# Altium project ASPLogger_Control_Unit.PrjPcb (part 1 of 2)
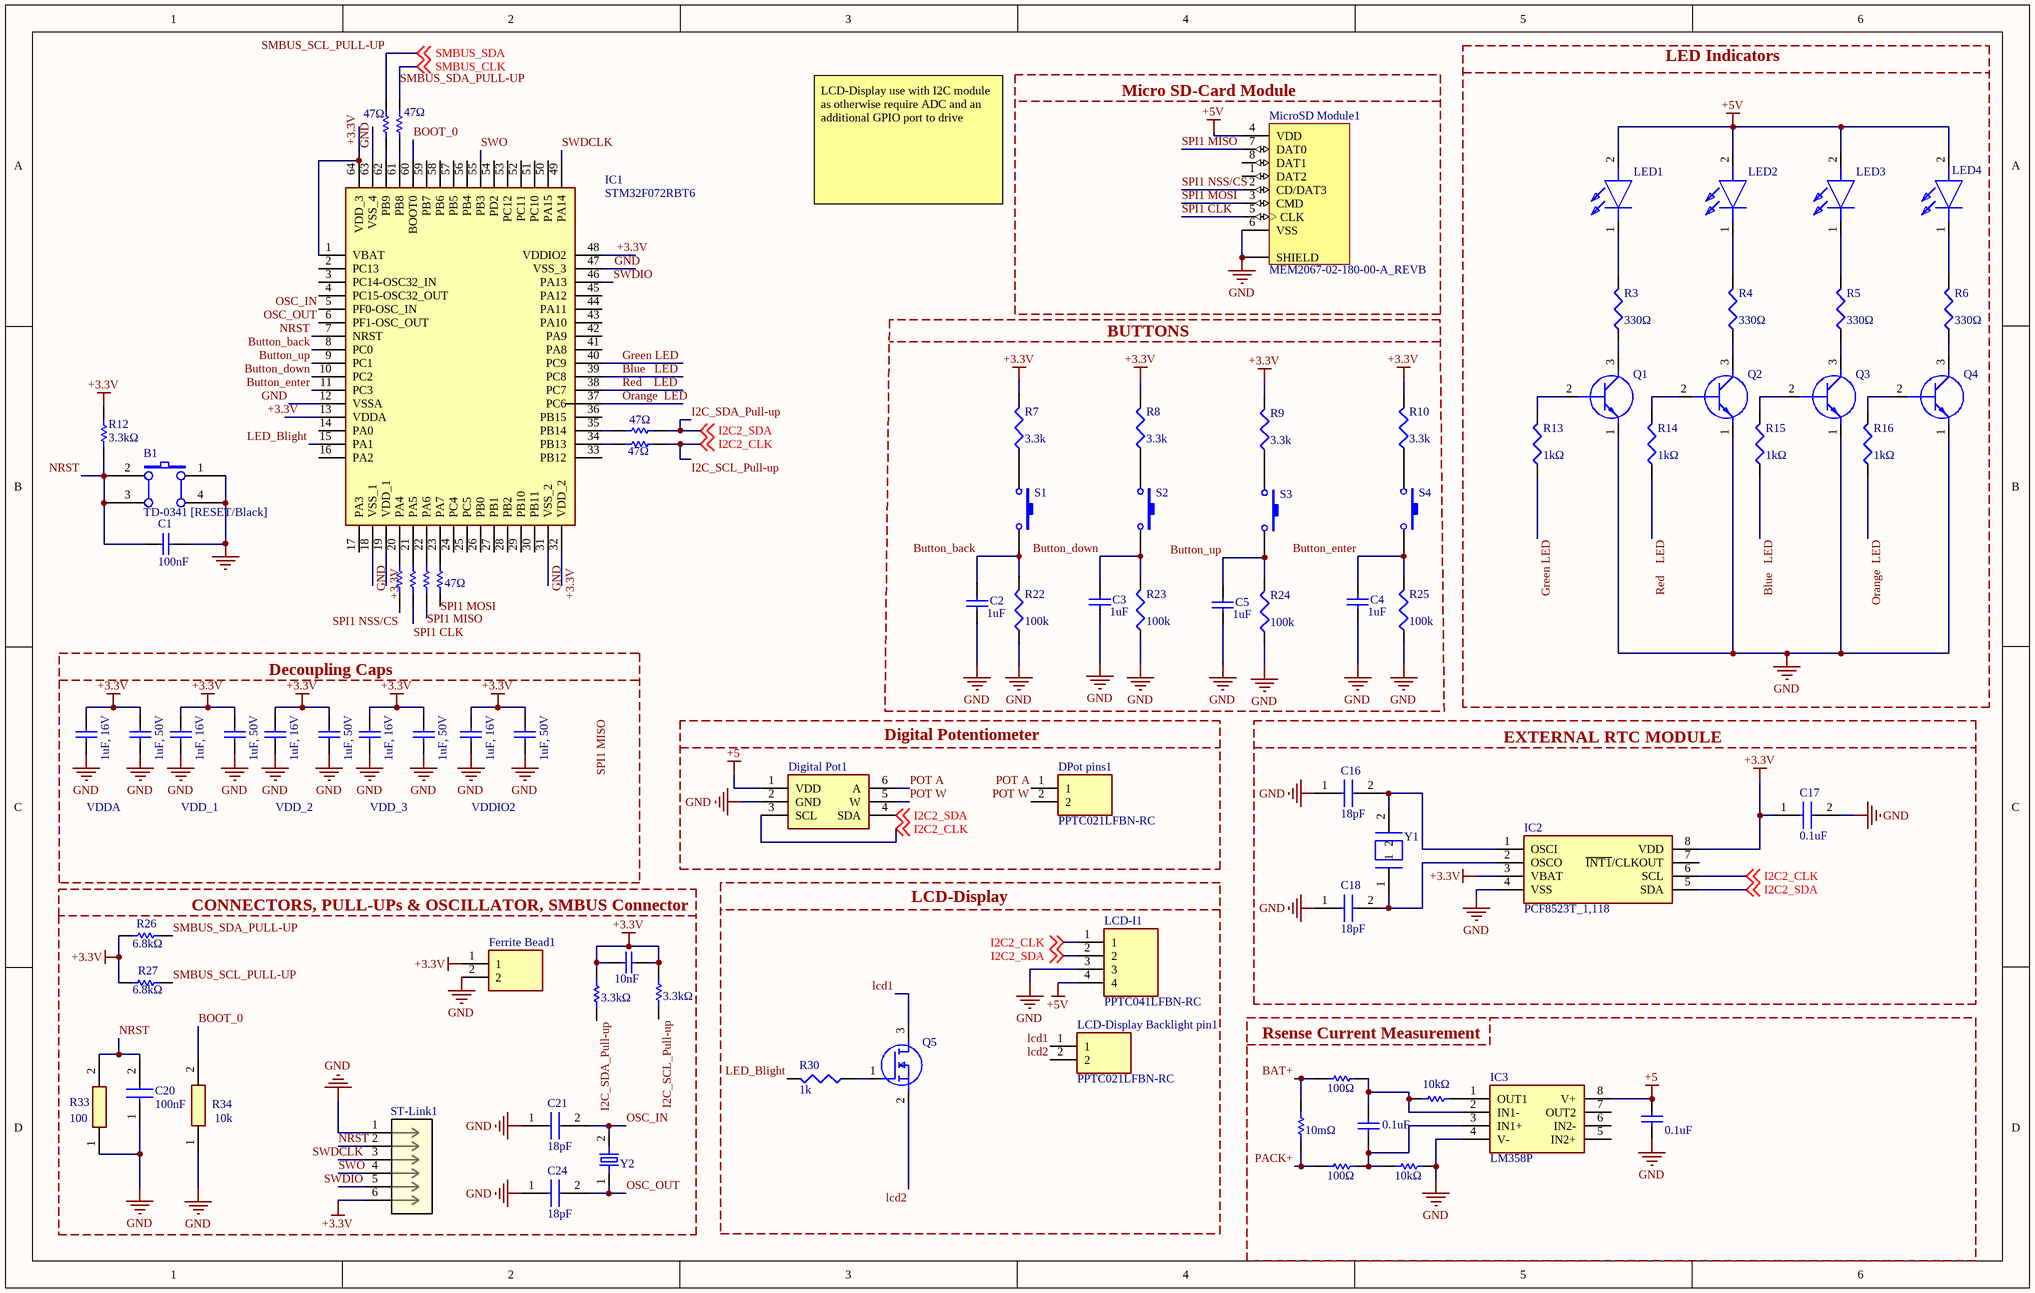
[diagram p0: Sheet1.SchDoc]
5 sheets, 250 parts. Net scope: global (net labels, ports and power ports of the same name join across sheets).
Board file: PCB1.PcbDoc
Sheets:
  Sheet1.SchDoc
  BQ34z100pwr.SchDoc
  LDO.SchDoc
  R5460.SchDoc
  ASP.SchDoc

## Sheet Sheet1.SchDoc
size 381 x 241 mm; SheetNumber: 1; SheetTotal: 5; SPICEModelCacheHRDCRIYR: <root> / <DocumentId>HRDCRIYR</DocumentId> / <CacheFrame Number="0"> / <Model Name="cap" Kind="MDL"> / <Text>*Default semiconductor capacitor / .MODEL CAP C()</Text> / </Model> / </CacheFrame> / </root>

### Parts
B1  TD-0341 [RESET/Black]  [PB10]
C1  100nF  [0603C]
C2  value 1uF  [RAD-0.3]  (hidden comment: Cap)
C3  value 1uF  [RAD-0.3]  (hidden comment: Cap)
C4  value 1uF  [RAD-0.3]  (hidden comment: Cap)
C5  value 1uF  [RAD-0.3]  (hidden comment: Cap)
C6  value 1uF, 16V  [RAD-0.3]  (hidden comment: Cap)
C7  value 1uF, 50V  [RAD-0.3]  (hidden comment: Cap)
C8  value 1uF, 16V  [RAD-0.3]  (hidden comment: Cap)
C9  value 1uF, 50V  [RAD-0.3]  (hidden comment: Cap)
C10  value 1uF, 16V  [RAD-0.3]  (hidden comment: Cap)
C11  value 1uF, 50V  [RAD-0.3]  (hidden comment: Cap)
C12  value 1uF, 16V  [RAD-0.3]  (hidden comment: Cap)
C13  value 1uF, 50V  [RAD-0.3]  (hidden comment: Cap)
C14  value 1uF, 16V  [RAD-0.3]  (hidden comment: Cap)
C15  value 1uF, 50V  [RAD-0.3]  (hidden comment: Cap)
C16  18pF  [CAPC3216X180N]
C17  0.1uF  [CAPC3216X180N]
C18  18pF  [CAPC3216X180N]
C19  value 10nF  [RAD-0.3]  (hidden comment: Cap)
C20  100nF  [CAPC3216X180N]
C21  18pF  [CAPC3216X180N]
C22  value 0.1uF  [RAD-0.3]  (hidden comment: Cap)
C23  value 0.1uF  [RAD-0.3]  (hidden comment: Cap)
C24  18pF  [CAPC3216X180N]
Digital_Pot1  AD5247BKSZ10-2RL7  [SOT65P210X110-6N]  (value not drawn)
DPot_pins1  PPTC021LFBN-RC  [RHDR2W80P0X254_1X2_558X254X850P]
Ferrite_Bead1  2506033007Y3  [BEADC1608X110N]  (value not drawn)
IC1  STM32F072RBT6  [QFP50P1200X1200X160-64N]
IC2  PCF8523T_1,118  [SOIC127P600X175-8N]
IC3  LM358P  [DIP794W53P254L959H508Q8N]
LCD-Display_Backlight_pin1  PPTC021LFBN-RC  [RHDR2W80P0X254_1X2_558X254X850P]
LCD-I1  PPTC041LFBN-RC  [RHDR4W80P0X254_1X4_1066X254X850P]
LED1  L-424IDT  [T-1_(3MM)_CYLINDRICAL_LED_LAMP]  (value not drawn)
LED2  L-424IDT  [T-1_(3MM)_CYLINDRICAL_LED_LAMP]  (value not drawn)
LED3  L-424IDT  [T-1_(3MM)_CYLINDRICAL_LED_LAMP]  (value not drawn)
LED4  L-424IDT  [T-1_(3MM)_CYLINDRICAL_LED_LAMP]  (value not drawn)
MicroSD_Module1  MEM2067-02-180-00-A_REVB  [GCT_MEM2067-02-180-00-A_REVB]
Q1  2n3904  [TO-92]  (value not drawn)
Q2  2n3904  [TO-92]  (value not drawn)
Q3  2n3904  [TO-92]  (value not drawn)
Q4  2n3904  [TO-92]  (value not drawn)
Q5  DMG6968UQ-7  [SOT96P240X100-3N]  (value not drawn)
R1  value 47Ω  [AXIAL-0.3]  (hidden comment: Res1)
R2  value 47Ω  [AXIAL-0.3]  (hidden comment: Res1)
R3  value 330Ω  [J1-0603]  (hidden comment: 330)
R4  value 330Ω  [J1-0603]  (hidden comment: 330)
R5  value 330Ω  [J1-0603]  (hidden comment: 330)
R6  value 330Ω  [J1-0603]  (hidden comment: 330)
R7  value 3.3k  [J1-0603]  (hidden comment: Res3)
R8  value 3.3k  [J1-0603]  (hidden comment: Res3)
R9  value 3.3k  [J1-0603]  (hidden comment: Res3)
R10  value 3.3k  [J1-0603]  (hidden comment: Res3)
R11  value 47Ω  [AXIAL-0.3]  (hidden comment: Res1)
R12  value 3.3kΩ  [AXIAL-0.3]  (hidden comment: Res1)
R13  value 1kΩ  [J1-0603]  (hidden comment: Res3)
R14  value 1kΩ  [J1-0603]  (hidden comment: Res3)
R15  value 1kΩ  [J1-0603]  (hidden comment: Res3)
R16  value 1kΩ  [J1-0603]  (hidden comment: Res3)
R17  value 47Ω  [AXIAL-0.3]  (hidden comment: Res1)
R18  Res1  [AXIAL-0.3]  (value not drawn)
R19  Res1  [AXIAL-0.3]  (value not drawn)
R20  Res1  [AXIAL-0.3]  (value not drawn)
R21  value 47Ω  [AXIAL-0.3]  (hidden comment: Res1)
R22  value 100k  [J1-0603]  (hidden comment: Res3)
R23  value 100k  [J1-0603]  (hidden comment: Res3)
R24  value 100k  [J1-0603]  (hidden comment: Res3)
R25  value 100k  [J1-0603]  (hidden comment: Res3)
R26  value 6.8kΩ  [AXIAL-0.3]  (hidden comment: Res1)
R27  value 6.8kΩ  [AXIAL-0.3]  (hidden comment: Res1)
R28  value 3.3kΩ  [AXIAL-0.3]  (hidden comment: Res1)
R29  value 3.3kΩ  [AXIAL-0.3]  (hidden comment: Res1)
R30  value 1k  [J1-0603]  (hidden comment: Res3)
R31  value 100Ω  [AXIAL-0.3]  (hidden comment: Res1)
R32  value 10kΩ  [AXIAL-0.3]  (hidden comment: Res1)
R33  100  [RESC1608X55N]
R34  10k  [RESC1608X55N]
R35  value 10mΩ  [AXIAL-0.3]  (hidden comment: Res1)
R36  value 100Ω  [AXIAL-0.3]  (hidden comment: Res1)
R37  value 10kΩ  [AXIAL-0.3]  (hidden comment: Res1)
S1  SW-PB  [SPST-2]  (value not drawn)
S2  SW-PB  [SPST-2]  (value not drawn)
S3  SW-PB  [SPST-2]  (value not drawn)
S4  SW-PB  [SPST-2]  (value not drawn)
ST-Link1  20021121-00006C4LF  [CONN_20021121-00006C4LF_AMP-M]  (value not drawn)
Y1  ABS07AIG-32.768KHZ-9-1-T  [XTAL320X150X90]  (value not drawn)
Y2  8 MHz ±20ppm  [XTAL500X320X130N]  (value not drawn)

### Blocks framed on the sheet
LED Indicators: LED1-LED4 Q1-Q4 R3-R6 R13-R16
Micro SD-Card Module: MicroSD_Module1
BUTTONS: C2-C5 R7-R10 R22-R25 S1-S4
Decoupling Caps: C6-C15
Digital Potentiometer: Digital_Pot1 DPot_pins1
LCD-Display: LCD-Display_Backlight_pin1 LCD-I1 Q5 R30
CONNECTORS, PULL-UPs & OSCILLATOR, SMBUS Connector: C19-C21 C24 Ferrite_Bead1 R26-R29 R33 R34 ST-Link1 Y2

### Nets
+3.3V: C6.1 C7.1 C8.1 C9.1 C10.1 C11.1 C12.1 C13.1 C14.1 C15.1 C17.1 C19.1 C19.2 Ferrite_Bead1.1 IC1.1(VBAT) IC1.13(VDDA) IC1.19(VDD_1) IC1.32(VDD_2) IC1.48(VDDIO2) IC1.64(VDD_3) IC2.3(VBAT) IC2.8(VDD) R7.2 R8.2 R9.2 R10.2 R12.2 R26.1 R27.1 R28.1 R29.1 ST-Link1.6
+5V: C22.1 Digital_Pot1.1(VDD) IC3.8(V+) LCD-I1.4 LED1.2(A) LED2.2(A) LED3.2(A) LED4.2(A) MicroSD_Module1.4(VDD)  [also labelled +5]
BAT+: R31.2 R35.2
GND: B1.1(A0) B1.4(A1) C1.1 C2.1 C3.1 C4.1 C5.1 C6.2 C7.2 C8.2 C9.2 C10.2 C11.2 C12.2 C13.2 C14.2 C15.2 C16.1 C17.2 C18.1 C20.1 C21.1 C22.2 C24.1 Digital_Pot1.2(GND) Ferrite_Bead1.2 IC1.12(VSSA) IC1.18(VSS_1) IC1.31(VSS_2) IC1.47(VSS_3) IC1.63(VSS_4) IC2.4(VSS) IC3.4(V-) LCD-I1.3 MicroSD_Module1.6(VSS) MicroSD_Module1.9(SHIELD) MicroSD_Module1.10(SHIELD) MicroSD_Module1.11(SHIELD) MicroSD_Module1.12(SHIELD) Q1.1(E) Q2.1(E) Q3.1(E) Q4.1(E) R22.1 R23.1 R24.1 R25.1 R33.1 R34.1 R37.1 ST-Link1.1
PACK+: R35.1 R36.2
Blue   LED: IC1.39(PC8) R15.1
BOOT_0: IC1.60(BOOT0) R34.2
Button_back: C2.2 IC1.8(PC0) R22.2 S1.2
Button_down: C3.2 IC1.10(PC2) R23.2 S2.2
Button_enter: C4.2 IC1.11(PC3) R25.2 S4.2
Button_up: C5.2 IC1.9(PC1) R24.2 S3.2
Green LED: IC1.40(PC9) R13.1
I2C_SCL_Pull-up: Digital_Pot1.3(SCL) IC2.6(SCL) LCD-I1.1 R17.2 R29.2 ; off-sheet I2C2_CLK  [also labelled I2C2_CLK]
I2C_SDA_Pull-up: Digital_Pot1.4(SDA) IC2.5(SDA) LCD-I1.2 R11.2 R28.2 ; off-sheet I2C2_SDA  [also labelled I2C2_SDA]
lcd1: LCD-Display_Backlight_pin1.1 Q5.3(D)
lcd2: LCD-Display_Backlight_pin1.2 Q5.2(S)
LED_Blight: IC1.15(PA1) R30.2
NRST: B1.2(B0) B1.3(B1) C1.2 C20.2 IC1.7(NRST) R12.1 R33.2 ST-Link1.2
Orange  LED: IC1.37(PC6) R16.1
OSC_IN: C21.2 IC1.5(PF0-OSC_IN) Y2.2
OSC_OUT: C24.2 IC1.6(PF1-OSC_OUT) Y2.1
POT A: Digital_Pot1.6(A) DPot_pins1.1
POT W: Digital_Pot1.5(W) DPot_pins1.2
Red    LED: IC1.38(PC7) R14.1
SMBUS_SCL_PULL-UP: R1.2 R27.2 ; off-sheet SMBUS_SDA  [also labelled SMBUS_SDA]
SMBUS_SDA_PULL-UP: R2.2 R26.2 ; off-sheet SMBUS_CLK  [also labelled SMBUS_CLK]
SPI1 CLK: MicroSD_Module1.5(CLK) R19.1
SPI1 MISO: MicroSD_Module1.7(DAT0) R20.1
SPI1 MOSI: MicroSD_Module1.3(CMD) R21.1
SPI1 NSS/CS: MicroSD_Module1.2(CD/DAT3) R18.1
SWDCLK: IC1.49(PA14) ST-Link1.3
SWDIO: IC1.46(PA13) ST-Link1.5
SWO: IC1.55(PB3) ST-Link1.4
NetC16_2: C16.2 IC2.1(OSCI) Y1.2
NetC18_2: C18.2 IC2.2(OSCO) Y1.1
NetC23_1: C23.1 IC3.3(IN1+) R36.1 R37.2
NetC23_2: C23.2 IC3.2(IN1-) R31.1 R32.2
NetIC1_20: IC1.20(PA4) R18.2
NetIC1_21: IC1.21(PA5) R19.2
NetIC1_22: IC1.22(PA6) R20.2
NetIC1_23: IC1.23(PA7) R21.2
NetIC1_34: IC1.34(PB13) R17.1
NetIC1_35: IC1.35(PB14) R11.1
NetIC1_61: IC1.61(PB8) R2.1
NetIC1_62: IC1.62(PB9) R1.1
NetIC3_1: IC3.1(OUT1) R32.1
NetLED1_1: LED1.1(K) R3.2
NetLED2_1: LED2.1(K) R4.2
NetLED3_1: LED3.1(K) R5.2
NetLED4_1: LED4.1(K) R6.2
NetQ1_2: Q1.2(B) R13.2
NetQ1_3: Q1.3(C) R3.1
NetQ2_2: Q2.2(B) R14.2
NetQ2_3: Q2.3(C) R4.1
NetQ3_2: Q3.2(B) R15.2
NetQ3_3: Q3.3(C) R5.1
NetQ4_2: Q4.2(B) R16.2
NetQ4_3: Q4.3(C) R6.1
NetQ5_1: Q5.1(G) R30.1
NetR7_1: R7.1 S1.1
NetR8_1: R8.1 S2.1
NetR9_1: R9.1 S3.1
NetR10_1: R10.1 S4.1

Not connected (* = marked no-connect by the designer): IC1 2(PC13) 3(PC14-OSC32_IN) 4(PC15-OSC32_OUT) 14(PA0) 16(PA2) 17(PA3) 24(PC4) 25(PC5) 26(PB0) 27(PB1) 28(PB2) 29(PB10) 30(PB11) 33(PB12) 36(PB15) 41(PA8) 42(PA9) 43(PA10) 44(PA11) 45(PA12) 50(PA15) 51(PC10) 52(PC11) 53(PC12) 54(PD2) 56(PB4) 57(PB5) 58(PB6) 59(PB7); IC2 7(~{INT1}/CLKOUT); IC3 5(IN2+) 6(IN2-) 7(OUT2); MicroSD_Module1 1(DAT2) 8(DAT1)

### Notes on the sheet
- LCD-Display use with I2C module as otherwise require ADC and an additional GPIO port to drive
- EXTERNAL RTC MODULE
- VDDA
- VDD_1
- VDD_2
- VDD_3
- VDDIO2
- Rsense Current Measurement
- (near IC3) Noise can propagate into analog circuitry through the power pins of the circuit as a whole, as well as the operational amplifier. Bypass capacitors are used to reduce the coupled noise by providing low-impedance power sources local to the analog circuitry.
- Labels drawn without touching a wire or pin: SPI1 MISO

### Library data of the parts
B1 = SW PUSHBUTTON: SE PUSHBUTTON
C1 = CAP: Capacitor; Value: 100pF; Published: 8-Jun-2000; Revision: July-2002: Re-released for DXP Platform.; Publisher: Altium Limited
C2-C15 C19 C22 C23 = Cap: Capacitor; Published: 8-Jun-2000; LatestRevisionDate: 17-Jul-2002; LatestRevisionNote: Re-released for DXP Platform.; PackageReference: RAD-0.3; Publisher: Altium Limited; PackageDescription: Radial Cap, Thru-Hole; 2 Leads; 0.3 in Pin Spacing
C16-C18 C20 C21 C24 = GRM31CD80J107MEA8L: Capacitor; Manufacturer_Name: Murata Electronics; Height: 1.8mm; Manufacturer_Part_Number: GRM31CD80J107MEA8L; Mouser Part Number: 81-GRM31CD80J107MA8L; Mouser Price/Stock: https://www.mouser.co.uk/ProductDetail/Murata-Electronics/GRM31CD80J107MEA8L?qs=DPoM0jnrROWnWfPYsqocbw%3D%3D
Digital_Pot1 = AD5247BKSZ10-2RL7: Integrated Circuit; Manufacturer_Name: Analog Devices; Datasheet Link: https://www.analog.com/media/en/technical-documentation/data-sheets/AD5247.pdf; Height: 1.1mm; Manufacturer_Part_Number: AD5247BKSZ10-2RL7; Mouser Part Number: 584-AD5247BKSZ10-2R7; Mouser Price/Stock: https://www.mouser.co.uk/ProductDetail/Analog-Devices/AD5247BKSZ10-2RL7?qs=NmRFExCfTkEuDqKDhhBFmQ%3D%3D; Arrow Part Number: AD5247BKSZ10-2RL7; Arrow Price/Stock: https://www.arrow.com/en/products/ad5247bksz10-2rl7/analog-devices
DPot_pins1 LCD-Display_Backlight_pin1 = PPTC021LFBN-RC: Connector; Manufacturer_Name: Sullins; Datasheet Link: http://www.sullinscorp.com/drawings/78_P(N)PxCxxxLFBN-RC,_10492-H.pdf; Height: 8.5mm; Manufacturer_Part_Number: PPTC021LFBN-RC
Ferrite_Bead1 = 2506033007Y3: Ferrite Bead / 100 MHz, 3A, 40 Ohm; Manufacturer_Name: Fair-Rite; Datasheet Link: https://www.fair-rite.com/product/chip-beads-2506033007y3/; Height: 1.1mm; Manufacturer_Part_Number: 2506033007Y3; Mouser Part Number: 623-2506033007Y3; Mouser Price/Stock: https://www.mouser.co.uk/ProductDetail/Fair-Rite/2506033007Y3?qs=paL1wOLBYNf20sf8jiNk7A%3D%3D; Arrow Part Number: 2506033007Y3; Arrow Price/Stock: https://www.arrow.com/en/products/2506033007y3/fair-rite-products
IC1 = STM32F072RBT6: Integrated Circuit; Manufacturer_Name: STMicroelectronics; Datasheet Link: http://www.st.com/st-web-ui/static/active/en/resource/technical/document/datasheet/DM00090510.pdf; Height: 1.6mm; Manufacturer_Part_Number: STM32F072RBT6; Mouser Part Number: 511-STM32F072RBT6; Mouser Price/Stock: https://www.mouser.co.uk/ProductDetail/STMicroelectronics/STM32F072RBT6?qs=xf9JV0PLFEcuk6sTlnutaw%3D%3D; Arrow Part Number: STM32F072RBT6; Arrow Price/Stock: https://www.arrow.com/en/products/stm32f072rbt6/stmicroelectronics
IC2 = PCF8523T_1,118: Integrated Circuit; Manufacturer_Name: NXP; Manufacturer_Part_Number: PCF8523T/1,118; Datasheet Link: http://www.nxp.com/docs/en/data-sheet/PCF8523.pdf; Height: 1.75mm; Mouser Part Number: 771-PCF8523T/1118; Mouser Price/Stock: https://www.mouser.co.uk/ProductDetail/NXP-Semiconductors/PCF8523T-1118?qs=beN0Cyoe8YmmXShRMIPCwg%3D%3D; Arrow Part Number: PCF8523T/1,118; Arrow Price/Stock: https://www.arrow.com/en/products/pcf8523t1118/nxp-semiconductors?region=nac
IC3 = LM358P: Integrated Circuit; Manufacturer_Name: Texas Instruments; Datasheet Link: http://www.ti.com/lit/ds/symlink/lm358a.pdf; Height: 5.08mm; Manufacturer_Part_Number: LM358P; Mouser Part Number: 595-LM358P; Mouser Price/Stock: https://www.mouser.co.uk/ProductDetail/Texas-Instruments/LM358P?qs=X1HXWTtiZ0QtOTT8%252BVnsyw%3D%3D; Arrow Part Number: LM358P; Arrow Price/Stock: https://www.arrow.com/en/products/lm358p/texas-instruments?region=nac
LCD-I1 = PPTC041LFBN-RC: Connector; Manufacturer_Name: Sullins; Datasheet Link: http://www.sullinscorp.com/drawings/78_P(N)PxCxxxLFBN-RC,_10492-H.pdf; Height: 8.5mm; Manufacturer_Part_Number: PPTC041LFBN-RC
LED1-LED4 = L-424IDT: LED; Manufacturer_Name: Kingbright; Datasheet Link: https://componentsearchengine.com/Datasheets/2/L-424IDT.pdf; Manufacturer_Part_Number: L-424IDT; Mouser Part Number: N/A; Mouser Price/Stock: https://www.mouser.com/Search/Refine.aspx?Keyword=N%2FA; Arrow Part Number: L-424IDT; Arrow Price/Stock: https://www.arrow.com/en/products/l-424idt/kingbright
MicroSD_Module1 = MEM2067-02-180-00-A_REVB: 8 Position Card Connector microSDâ„¢ Surface Mount, Right Angle Gold; MF: Global Connector Technology; Package: None; Value: *; Price: None; MP: MEM2067-02-180-00-A; SnapEDA_Link: https://www.snapeda.com/parts/MEM2067-02-180-00-A/Global%20Connector%20Technology/view-part/779218/?ref=snap; Availability: Unavailable
Q1-Q4 = 2n3904: Transistor BJT NPN; Manufacturer_Name: STMicroelectronics; Datasheet Link: https://datasheet.datasheetarchive.com/originals/distributors/Datasheets-5/DSA-93219.pdf; Manufacturer_Part_Number: 2n3904; Mouser Part Number: 511-2N3904; Mouser Price/Stock: https://www.mouser.co.uk/ProductDetail/STMicroelectronics/2N3904?qs=ljbEvF4DwOMFlSOlAhVGRg%3D%3D
Q5 = DMG6968UQ-7: MOSFET (N-Channel); Manufacturer_Name: Diodes Inc.; Datasheet Link: https://www.arrow.com/en/products/dmg6968uq-7/diodes-incorporated; Height: 1mm; Manufacturer_Part_Number: DMG6968UQ-7; Mouser Part Number: 621-DMG6968UQ-7; Mouser Price/Stock: https://www.mouser.co.uk/ProductDetail/Diodes-Incorporated/DMG6968UQ-7?qs=MNIFWdyJgboErGB0%2FFpP4Q%3D%3D; Arrow Part Number: DMG6968UQ-7; Arrow Price/Stock: https://www.arrow.com/en/products/dmg6968uq-7/diodes-incorporated
R1 R2 R11 R12 R17 R21 R26-R29 R31 R32 R35-R37 = Res1: Resistor; Published: 8-Jun-2000; LatestRevisionDate: 17-Jul-2002; LatestRevisionNote: Re-released for DXP Platform.; PackageReference: AXIAL-0.3; Publisher: Altium Limited; PackageDescription: Axial Device, Thru-Hole; 2 Leads; 0.3 in Pin Spacing
R3-R10 R13-R16 R22-R25 R30 = Res3: Resistor; Published: 8-Jun-2000; LatestRevisionDate: 29-May-2009; LatestRevisionNote: IPC-7351 Footprint Added.; PackageReference: J1-0603; Publisher: Altium Limited; PackageDescription: Chip Resistor
R18 = Res1: Resistor; Value: 1kΩ; Published: 8-Jun-2000; LatestRevisionDate: 17-Jul-2002; LatestRevisionNote: Re-released for DXP Platform.; PackageReference: AXIAL-0.3; Publisher: Altium Limited; PackageDescription: Axial Device, Thru-Hole; 2 Leads; 0.3 in Pin Spacing
R19 R20 = Res1: Resistor; Value: 47Ω; Published: 8-Jun-2000; LatestRevisionDate: 17-Jul-2002; LatestRevisionNote: Re-released for DXP Platform.; PackageReference: AXIAL-0.3; Publisher: Altium Limited; PackageDescription: Axial Device, Thru-Hole; 2 Leads; 0.3 in Pin Spacing
R33 R34 = CRG0603F470R: Resistor; Manufacturer_Name: TE Connectivity; Datasheet Link: https://datasheet.datasheetarchive.com/originals/distributors/DKDS-21/401698.pdf; Height: 0.55mm; Manufacturer_Part_Number: CRG0603F470R; Mouser Part Number: 279-CRG0603F470R; Mouser Price/Stock: https://www.mouser.co.uk/ProductDetail/TE-Connectivity-Holsworthy/CRG0603F470R?qs=VHcS2MTj4gZ9vO%2FWGoSTFA%3D%3D; Arrow Part Number: CRG0603F470R; Arrow Price/Stock: https://www.arrow.com/en/products/crg0603f470r/te-connectivity?region=nac
S1-S4 = SW-PB: Switch; Published: 24-Mar-1999; LatestRevisionDate: 17-Jul-2002; LatestRevisionNote: Re-released for DXP Platform.; PackageReference: SPST-2; Publisher: Altium Limited; PackageDescription: Switch; 2 Leads
ST-Link1 = 20021121-00006C4LF: ST-Link; Mfr_Name: Amphenol ICC; Manufacturer_Part_Number: 20021121-00006C4LF; Copyright: Copyright (C) 2022 Ultra Librarian. All rights reserved.; RefDes: RefDes; Type: DEV
Y1 = ABS07AIG-32.768KHZ-9-1-T: 32.768kHz Â±10ppm Crystal 9pF 80 kOhms 2-SMD, No Lead; MF: Abracon; Package: SMD-2 Abracon; MP: ABS07AIG-32.768KHZ-9-1-T; SnapEDA_Link: https://www.snapeda.com/parts/ABS07AIG-32.768KHZ-9-1-T/Abracon%20LLC/view-part/588516/?ref=snap; Price: None; Value: *; Availability: Unavailable
Y2 = ABM3-16.000MHZ-D2Y-T: 16MHz Â±20ppm Crystal 18pF 40 Ohms 2-SMD, No Lead; MF: Abracon; SnapEDA_Link: https://www.snapeda.com/parts/ABM3-16.000MHZ-D2Y/Abracon/view-part/1217081/?ref=snap; MP: ABM3-16.000MHZ-D2Y; Availability: Unavailable; Package: SMD-2 Abracon; Price: None; Value: *

## Sheet BQ34z100pwr.SchDoc
size A4; SheetNumber: 2; SheetTotal: 4
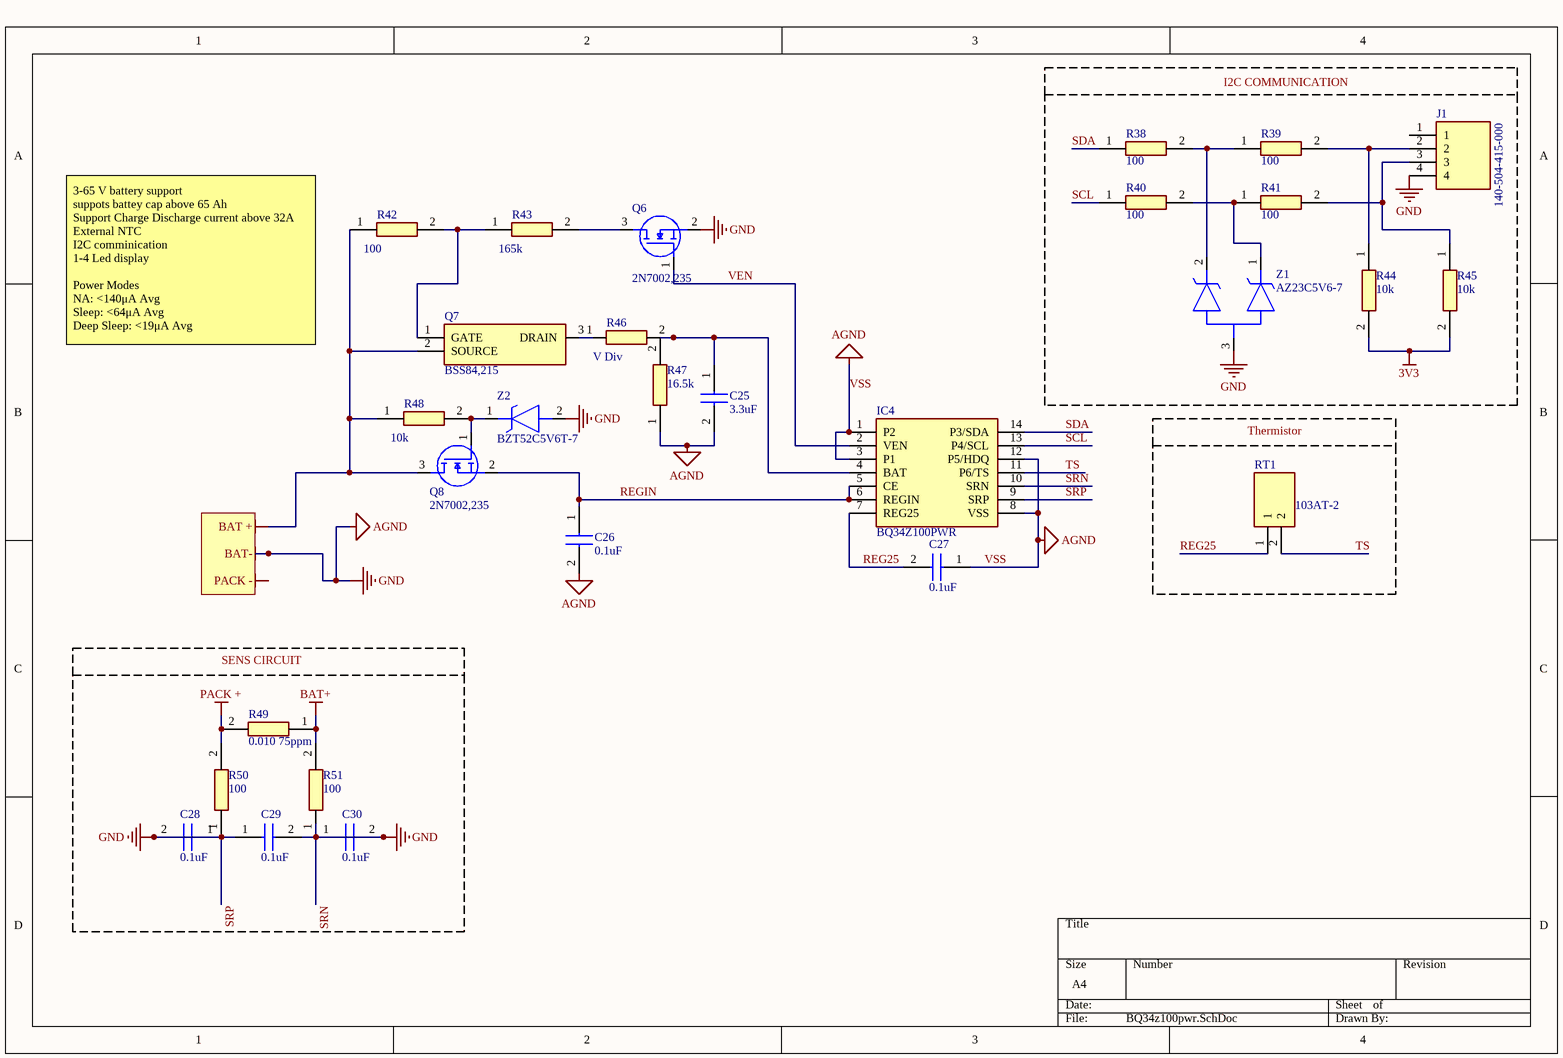
[diagram p1: BQ34z100pwr.SchDoc]

### Parts
C25  3.3uF  [CAPC1608X90N]
C26  0.1uF  [CAPC1608X90N]
C27  0.1uF  [CAPC1608X90N]
C28  0.1uF  [CAPC1608X90N]
C29  0.1uF  [CAPC1608X90N]
C30  0.1uF  [CAPC1608X90N]
IC4  BQ34Z100PWR  [SOP65P640X120-14N]
J1  140-504-415-000  [140504415000]
Q6  2N7002,235  [SOT95P230X110-3N]
Q7  BSS84,215  [SOT95P230X110-3N]
Q8  2N7002,235  [SOT95P230X110-3N]
R38  100  [RESC1608X55N]
R39  100  [RESC1608X55N]
R40  100  [RESC1608X55N]
R41  100  [RESC1608X55N]
R42  100  [RESC1608X55N]
R43  165k  [RESC1608X55N]
R44  10k  [RESC1608X55N]
R45  10k  [RESC1608X55N]
R46  V Div  [RESC1608X55N]
R47  16.5k  [RESC1608X55N]
R48  10k  [RESC1608X55N]
R49  0.010 75ppm  [RESC1608X55N]
R50  100  [RESC1608X55N]
R51  100  [RESC1608X55N]
RT1  103AT-2  [103AT2]
Z1  AZ23C5V6-7  [SOT96P240X110-3N]
Z2  BZT52C5V6T-7  [SODFL1608X65N]

### Blocks framed on the sheet
I2C COMMUNICATION: J1 R38-R41 R44 R45 Z1
Thermistor: RT1
SENS CIRCUIT: C28-C30 R49-R51

### Nets
3V3: R44.2 R45.2
BAT +: Q7.2(SOURCE) Q8.3(D) R42.1 R48.1
BAT+: R49.1 R51.2
GND: C25.2 C26.2 C27.1 C28.1 C28.2 C29.1 C29.2 C30.1 C30.2 IC4.1(P2) IC4.3(P1) IC4.8(VSS) IC4.9(SRP) IC4.10(SRN) IC4.12(P5/HDQ) J1.4 Q6.2(S) R47.1 R50.1 R51.1 Z1.3(COMMON_ANODE) Z2.2(A)  [also labelled AGND, BAT-, SRN, SRP, VSS]
PACK +: R49.2 R50.2
REG25: C27.2 IC4.7(REG25) RT1.1
REGIN: C26.1 IC4.5(CE) IC4.6(REGIN) Q8.2(S)
SCL: IC4.13(P4/SCL) R40.1
SDA: IC4.14(P3/SDA) R38.1
TS: IC4.11(P6/TS) RT1.2
VEN: IC4.2(VEN) Q6.1(G)
NetC25_1: C25.1 IC4.4(BAT) R46.2 R47.2
NetJ1_2: J1.2 R39.2 R44.1
NetJ1_3: J1.3 R41.2 R45.1
NetQ6_3: Q6.3(D) R43.2
NetQ7_1: Q7.1(GATE) R42.2 R43.1
NetQ7_3: Q7.3(DRAIN) R46.1
NetQ8_1: Q8.1(G) R48.2 Z2.1(K)
NetR38_2: R38.2 R39.1 Z1.2(CATHODE_2)
NetR40_2: R40.2 R41.1 Z1.1(CATHODE_1)

Not connected (* = marked no-connect by the designer): J1 1

### Notes on the sheet
- 3-65 V battery support
  suppots battey cap above 65 Ah
  Support Charge Discharge current above 32A
  External NTC
  I2C comminication
  1-4 Led display
  Power Modes
  NA: <140μA Avg
  Sleep: <64μA Avg
  Deep Sleep: <19μA Avg
- Labels drawn without touching a wire or pin: PACK -

### Library data of the parts
C25-C30 = EMK107B7104KAHT: Capacitor; Manufacturer_Name: TAIYO YUDEN; Datasheet Link: https://componentsearchengine.com/Datasheets/2/EMK107B7104KAHT.pdf; Height: 0.9mm; Manufacturer_Part_Number: EMK107B7104KAHT; Mouser Part Number: 963-EMK107B7104KAHT; Mouser Price/Stock: https://www.mouser.co.uk/ProductDetail/Taiyo-Yuden/EMK107B7104KAHT?qs=Va%252BXcMGJzEvYcymJV6GEGg%3D%3D
IC4 = BQ34Z100PWR: Integrated Circuit; Manufacturer_Name: Texas Instruments; Datasheet Link: https://www.ti.com/lit/ds/symlink/bq34z100.pdf?HQS=dis-dk-null-digikeymode-dsf-pf-null-wwe&ts=1639563438358&ref_url=https%253A%252F%252Fwww.ti.com%252Fgeneral%252Fdocs%252Fsuppproductinfo.tsp%253FdistId%253D10%2526gotoUrl%253Dhttps%253A%252F%252Fwww.ti.co; Height: 1.2mm; Manufacturer_Part_Number: BQ34Z100PWR; Mouser Part Number: 595-BQ34Z100PWR; Mouser Price/Stock: https://www.mouser.co.uk/ProductDetail/Texas-Instruments/BQ34Z100PWR?qs=Zv8nmyeoaKtU157avFmCXg%3D%3D; Arrow Part Number: BQ34Z100PWR; Arrow Price/Stock: https://www.arrow.com/en/products/bq34z100pwr/texas-instruments
J1 = 140-504-415-000: Connector; Manufacturer_Name: EDAC; Datasheet Link: https://files.edac.net/edac/content/140/140-504-415-000%20-%20EDAC%20E-MATE%20(Pin%20Header)%20Connector.PDF; Height: 5.25mm; Manufacturer_Part_Number: 140-504-415-000; Mouser Part Number: 587-140-504-415-000; Mouser Price/Stock: https://www.mouser.co.uk/ProductDetail/EDAC/140-504-415-000?qs=zW32dvEIR3t2whP8kwSMKQ%3D%3D
Q6 Q8 = 2N7002,235: MOSFET (N-Channel); Manufacturer_Name: Nexperia; Datasheet Link: https://assets.nexperia.com/documents/data-sheet/2N7002.pdf; Height: 1.1mm; Manufacturer_Part_Number: 2N7002,235; Mouser Part Number: 771-2N7002235; Mouser Price/Stock: https://www.mouser.co.uk/ProductDetail/Nexperia/2N7002235?qs=AX3SRYwdf7Gv59FeQZ%2FkYw%3D%3D; Arrow Part Number: 2N7002,235; Arrow Price/Stock: https://www.arrow.com/en/products/2n7002235/nexperia
Q7 = BSS84,215: Transistor; Manufacturer_Name: Nexperia; Datasheet Link: https://componentsearchengine.com/Datasheets/2/BSS84,215.pdf; Height: 1.1mm; Manufacturer_Part_Number: BSS84,215; Mouser Part Number: 771-BSS84-T/R; Mouser Price/Stock: https://www.mouser.co.uk/ProductDetail/Nexperia/BSS84215?qs=me8TqzrmIYUAnPU0lBnsXg%3D%3D; Arrow Part Number: BSS84,215; Arrow Price/Stock: https://www.arrow.com/en/products/bss84215/nexperia?region=nac
R38-R51 = CR0603-FX-1003ELF: Resistor; Manufacturer_Name: Bourns; Datasheet Link: https://www.bourns.com/pdfs/chpreztr.pdf; Height: 0.55mm; Manufacturer_Part_Number: CR0603-FX-1003ELF; Mouser Part Number: 652-CR0603-FX-103ELF; Mouser Price/Stock: https://www.mouser.co.uk/ProductDetail/Bourns/CR0603-FX-1003ELF?qs=K5ddiUFZPT49r0RoKWcKqg%3D%3D; Arrow Part Number: CR0603-FX-1003ELF; Arrow Price/Stock: https://www.arrow.com/en/products/cr0603-fx-1003elf/bourns?region=europe
RT1 = 103AT-2: Thermistor; Manufacturer_Name: Semitec; Datasheet Link: https://datasheet.datasheetarchive.com/originals/distributors/Datasheets-30/DSA-588185.pdf; Height: 8mm; Manufacturer_Part_Number: 103AT-2; Mouser Part Number: 954-103AT-2; Mouser Price/Stock: https://www.mouser.co.uk/ProductDetail/Semitec/103AT-2?qs=wgO0AD0o1vvcDzsKguD%252Bew%3D%3D
Z1 = AZ23C5V6-7: Zener Diode; Manufacturer_Name: Diodes Inc.; Datasheet Link: https://www.diodes.com/assets/Datasheets/ds18003.pdf; Height: 1.1mm; Manufacturer_Part_Number: AZ23C5V6-7; Mouser Part Number: 621-AZ23C5V6; Mouser Price/Stock: https://www.mouser.co.uk/ProductDetail/Diodes-Incorporated/AZ23C5V6-7?qs=SSucg2PyLi7liuy0Pq8%2FiA%3D%3D
Z2 = BZT52C5V6T-7: Zener Diode; Manufacturer_Name: Diodes Inc.; Datasheet Link: https://www.mouser.com/datasheet/2/115/ds30502-1142513.pdf; Height: 0.65mm; Manufacturer_Part_Number: BZT52C5V6T-7; Mouser Part Number: 621-BZT52C5V6T-7; Mouser Price/Stock: https://www.mouser.co.uk/ProductDetail/Diodes-Incorporated/BZT52C5V6T-7?qs=zLeapIUCO8Tm%252BIuaCPAdkQ%3D%3D; Arrow Part Number: BZT52C5V6T-7; Arrow Price/Stock: https://www.arrow.com/en/products/bzt52c5v6t-7/diodes-incorporated?region=nac

## Sheet LDO.SchDoc
size A4; SheetNumber: 3; SheetTotal: 4
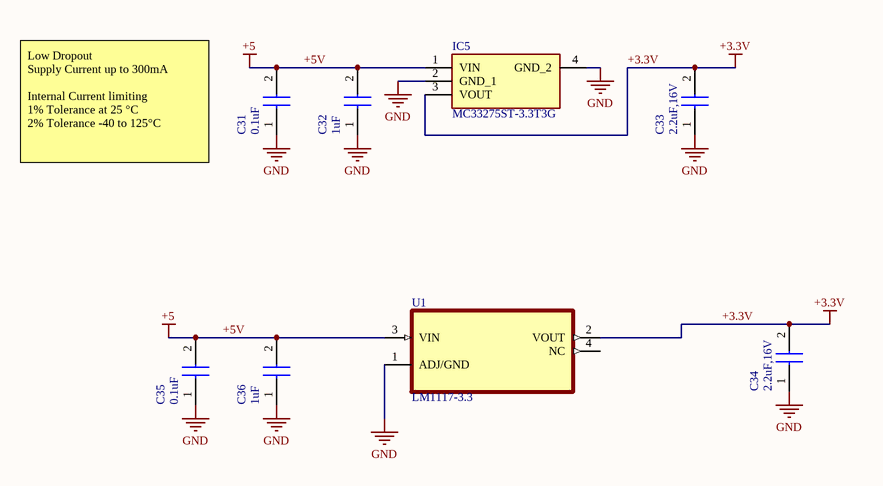
[diagram p2: LDO.SchDoc]

### Parts
C31  0.1uF  [CAPC1608X90N]
C32  1uF  [CAPC1608X90N]
C33  2.2uF,16V  [CAPC1608X90N]
C34  2.2uF,16V  [CAPC1608X90N]
C35  0.1uF  [CAPC1608X90N]
C36  1uF  [CAPC1608X90N]
IC5  MC33275ST-3.3T3G  [SOT230P700X175-4N]
U1  LM1117-3.3  [SOT230]

### Nets
+3.3V: C33.2 C34.2 IC5.3(VOUT) U1.2(VOUT)
+5V: C31.2 C32.2 C35.2 C36.2 IC5.1(VIN) U1.3(VIN)  [also labelled +5]
GND: C31.1 C32.1 C33.1 C34.1 C35.1 C36.1 IC5.2(GND_1) IC5.4(GND_2) U1.1(ADJ/GND)

Not connected (* = marked no-connect by the designer): U1 4(NC)

### Notes on the sheet
- Low Dropout
  Supply Current up to 300mA
  Internal Current limiting
  1% Tolerance at 25 °C
  2% Tolerance -40 to 125°C

### Library data of the parts
C31-C36 = EMK107B7104KAHT: as C25 on sheet BQ34z100pwr; Datasheet Link: https://componentsearchengine.com/Datasheets/2/EMK107B7104KAHT.pdf; Height: 0.9mm; Manufacturer_Part_Number: EMK107B7104KAHT; Mouser Part Number: 963-EMK107B7104KAHT; Mouser Price/Stock: https://www.mouser.co.uk/ProductDetail/Taiyo-Yuden/EMK107B7104KAHT?qs=Va%252BXcMGJzEvYcymJV6GEGg%3D%3D
IC5 = MC33275ST-3.3T3G: Integrated Circuit; Manufacturer_Name: onsemi; Datasheet Link: http://www.onsemi.com/pub/Collateral/MC33275-D.PDF; Height: 1.75mm; Manufacturer_Part_Number: MC33275ST-3.3T3G; Mouser Part Number: 863-MC33275ST-3.3T3G; Mouser Price/Stock: https://www.mouser.co.uk/ProductDetail/ON-Semiconductor/MC33275ST-33T3G?qs=dFKnUM%2FquJbQYa4LZ%2FVbxA%3D%3D; Arrow Part Number: MC33275ST-3.3T3G; Arrow Price/Stock: https://www.arrow.com/en/products/mc33275st-3.3t3g/on-semiconductor
U1 = LM1117-3.3: Regulador de tensÃ£o linear IC 1 Output 800mA SOT-223-4; MF: Texas Instruments; MP: LM1117-3.3; Package: SOT-223-4 Texas Instruments; Price: None; Availability: Unavailable; SnapEDA_Link: https://www.snapeda.com/parts/LM1117-3.3/Texas%20Instruments/view-part/549181/?ref=snap; Value: *

## Sheet R5460.SchDoc
size A4; SheetNumber: 4; SheetTotal: 5
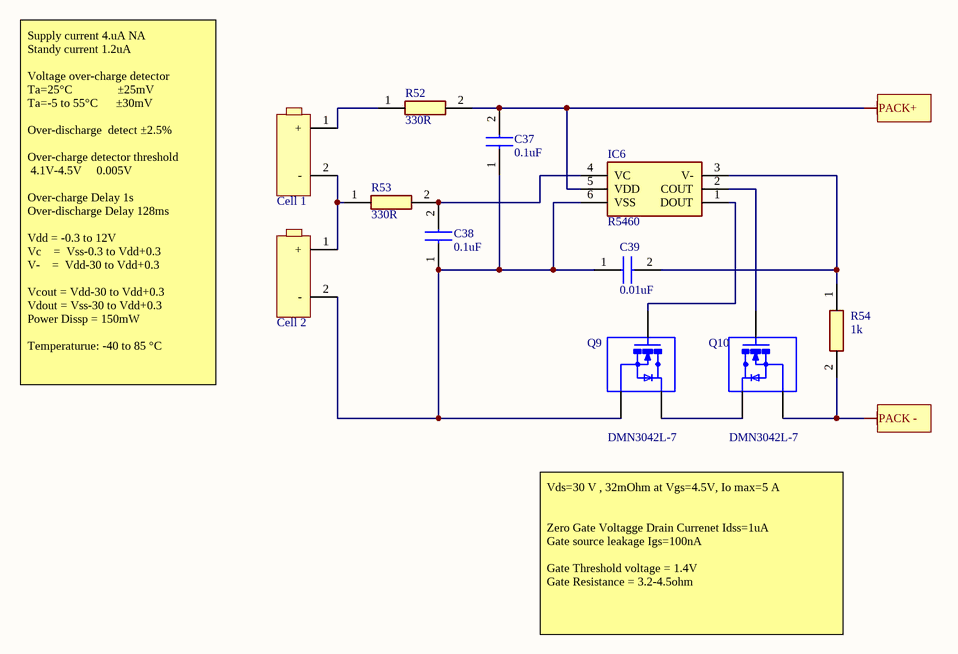
[diagram p3: R5460.SchDoc]

### Parts
C37  0.1uF  [CAPC3216X180N]
C38  0.1uF  [CAPC3216X180N]
C39  0.01uF  [CAPC3216X180N]
Cell_1  Cell  [Cell]  (value not drawn)
Cell_2  Cell  [Cell]  (value not drawn)
IC6  R5460  [SOT95P280X140-6N]
Q9  DMN3042L-7  [SOT91P240X110-3N]
Q10  DMN3042L-7  [SOT91P240X110-3N]
R52  330R  [RESC1608X55N]
R53  330R  [RESC1608X55N]
R54  1k  [RESC1608X55N]

### Nets
PACK -: Q10.2(SOURCE) R54.2
PACK+: C37.2 IC6.5(VDD) R52.2
NetC37_1: C37.1 C38.1 C39.1 Cell_2.2(-) IC6.6(VSS) Q9.2(SOURCE)
NetC38_2: C38.2 IC6.4(VC) R53.2
NetC39_2: C39.2 IC6.3(V-) R54.1
NetCell_1_1: Cell_1.1(+) R52.1
NetCell_1_2: Cell_1.2(-) Cell_2.1(+) R53.1
NetIC6_1: IC6.1(DOUT) Q9.1(GATE)
NetIC6_2: IC6.2(COUT) Q10.1(GATE)
NetQ9_3: Q9.3(DRAIN) Q10.3(DRAIN)

### Notes on the sheet
- Supply current 4.uA NA
  Standy current 1.2uA
  Voltage over-charge detector
  Ta=25°C               ±25mV
  Ta=-5 to 55°C      ±30mV
  Over-discharge  detect ±2.5%
  Over-charge detector threshold
  4.1V-4.5V     0.005V
  Over-charge Delay 1s
  Over-discharge Delay 128ms
  Vdd = -0.3 to 12V
  Vc    =  Vss-0.3 to Vdd+0.3
  V-    =  Vdd-30 to Vdd+0.3
  Vcout = Vdd-30 to Vdd+0.3
  Vdout = Vss-30 to Vdd+0.3
  Power Dissp = 150mW
  Temperaturue: -40 to 85 °C
- Vds=30 V , 32mOhm at Vgs=4.5V, Io max=5 A
  Zero Gate Voltagge Drain Currenet Idss=1uA
  Gate source leakage Igs=100nA
  Gate Threshold voltage = 1.4V
  Gate Resistance = 3.2-4.5ohm

### Library data of the parts
C37-C39 = GRM31CD80J107MEA8L: as C16 on sheet Sheet1; Height: 1.8mm; Manufacturer_Part_Number: GRM31CD80J107MEA8L; Mouser Part Number: 81-GRM31CD80J107MA8L; Mouser Price/Stock: https://www.mouser.co.uk/ProductDetail/Murata-Electronics/GRM31CD80J107MEA8L?qs=DPoM0jnrROWnWfPYsqocbw%3D%3D
IC6 = R5460N212AF-TR-FE: Integrated Circuit; Manufacturer_Name: Ricoh; Datasheet Link: https://eagle.componentsearchengine.com/Datasheets/1/R5460N212AF-TR-FE.pdf; Height: 1.4mm; Manufacturer_Part_Number: R5460N212AF-TR-FE; Mouser Part Number: 848-R5460N212AF-TR; Mouser Price/Stock: https://www.mouser.co.uk/ProductDetail/Ricoh-Electronic-Devices-Company/R5460N212AF-TR-FE?qs=vLWxofP3U2zA%252BWVvFiMalQ%3D%3D
Q9 Q10 = DMN3042L-7: N-Channel 30V 5.8A (Ta) 720mW (Ta) Surface Mount SOT-23; MF: Diodes Inc.; Value: *; Package: SOT-23-3 Diodes Inc.; Check_prices: https://www.snapeda.com/parts/DMN3042L-7/Diodes%20Inc./view-part/827647/?ref=eda; SnapEDA_Link: https://www.snapeda.com/parts/DMN3042L-7/Diodes%20Inc./view-part/827647/?ref=snap; Digi-Key_Part_Number: DMN3042L-7DICT-ND; MP: DMN3042L-7
R52-R54 = CR0603-FX-1003ELF: Resistor; Manufacturer_Name: Bourns; Datasheet Link: https://www.bourns.com/pdfs/chpreztr.pdf; Height: 0.55mm; Manufacturer_Part_Number: CR0603-FX-1003ELF; Mouser Part Number: 652-CR0603-FX-103ELF; Mouser Price/Stock: https://www.mouser.co.uk/ProductDetail/Bourns/CR0603-FX-1003ELF?qs=K5ddiUFZPT49r0RoKWcKqg%3D%3D; Arrow Part Number: CR0603-FX-1003ELF; Arrow Price/Stock: https://www.arrow.com/en/products/cr0603-fx-1003elf/bourns?region=europe